# Altium schematic sheet WIFIModule.SchDoc
size A4; SheetNumber: 13; SheetTotal: 22
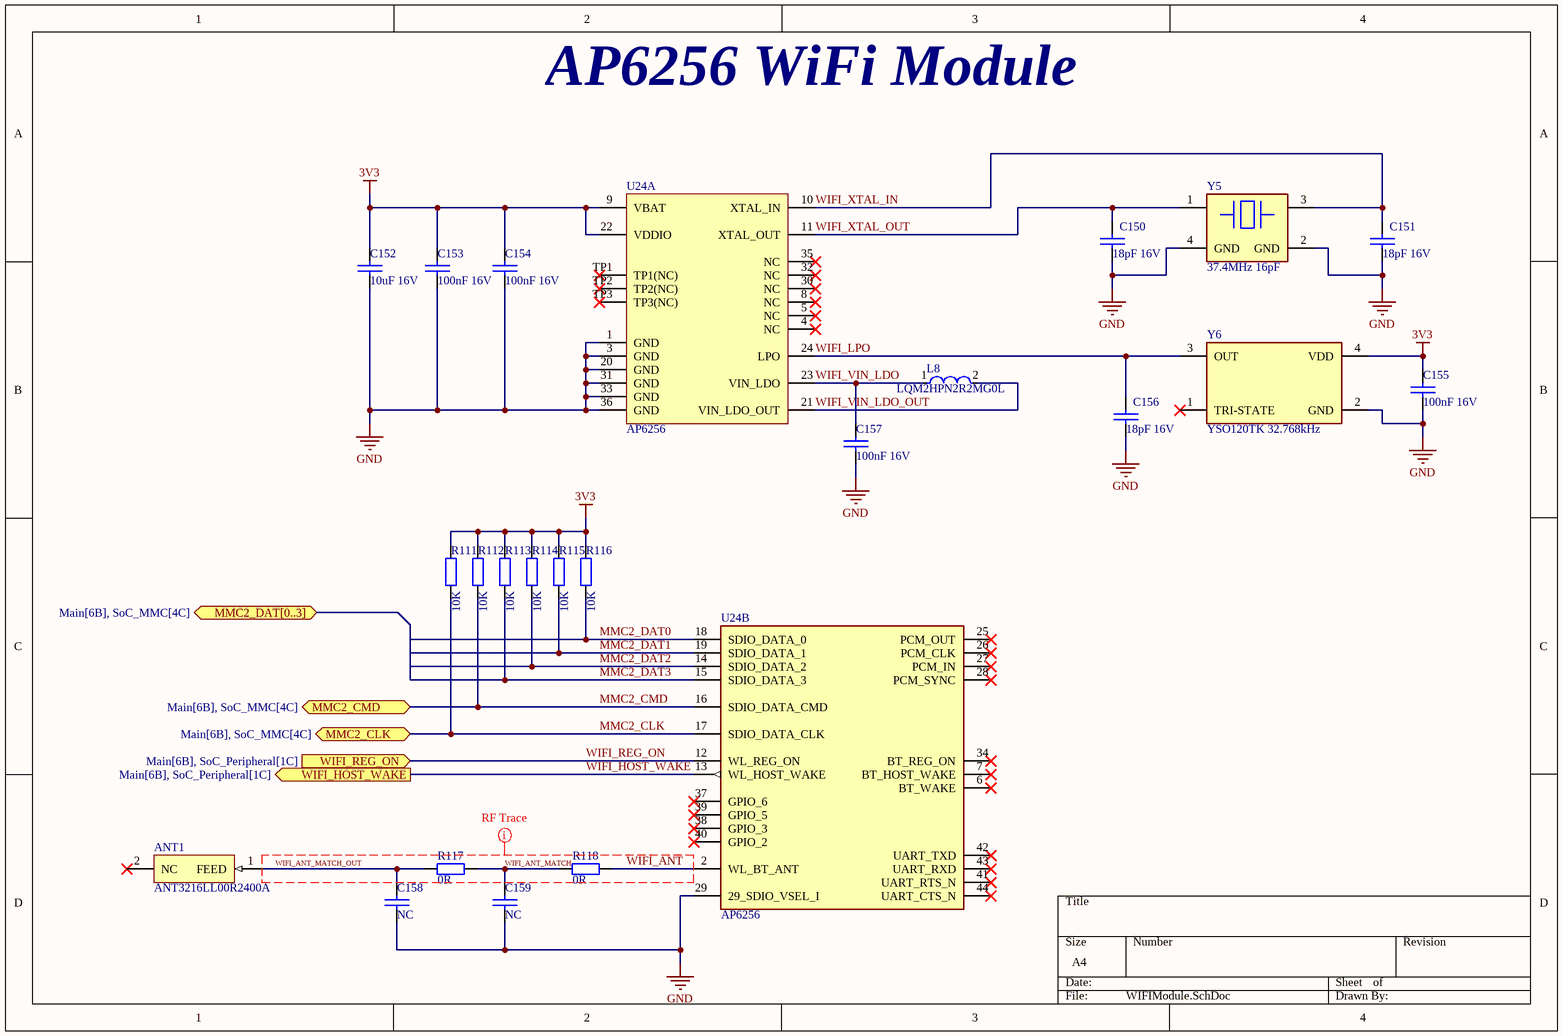
[diagram p0: WIFIModule.SchDoc]

## Parts
ANT1  ANT3216LL00R2400A  [ANT_1206]
C150  18pF 16V  [C_0402]
C151  18pF 16V  [C_0402]
C152  10uF 16V  [C_0603]
C153  100nF 16V  [C_0402]
C154  100nF 16V  [C_0402]
C155  100nF 16V  [C_0402]
C156  18pF 16V  [C_0402]
C157  100nF 16V  [C_0402]
C158  NC  [C_0402]
C159  NC  [C_0402]
L8  LQM2HPN2R2MG0L  [FP-LQM2HPN_G0-IPC_C]
R111  10K  [R_0402]
R112  10K  [R_0402]
R113  10K  [R_0402]
R114  10K  [R_0402]
R115  10K  [R_0402]
R116  10K  [R_0402]
R117  0R  [R_0402]
R118  0R  [R_0402]
U24  AP6256  [AP6256]  (parts A,B of 2)
Y5  37.4MHz 16pF  [CRYSTAL_SMD3225-4P]
Y6  YSO120TK 32.768kHz  [CRYSTAL_SMD3225-4P]

## Ports
MMC2_CLK (bidir, see Main[6B], SoC_MMC[4C]), MMC2_CMD (bidir, see Main[6B], SoC_MMC[4C]), MMC2_DAT[0..3] (bidir, see Main[6B], SoC_MMC[4C]), WIFI_HOST_WAKE (out, see Main[6B], SoC_Peripheral[1C]), WIFI_REG_ON (in, see Main[6B], SoC_Peripheral[1C])

## Nets
3V3: C152.1 C153.1 C154.1 C155.1 R111.2 R112.2 R113.2 R114.2 R115.2 R116.2 U24.9(VBAT) U24.22(VDDIO) Y6.4(VDD)
GND: C150.1 C151.1 C152.2 C153.2 C154.2 C155.2 C156.1 C157.2 C158.2 C159.2 U24.1(GND) U24.3(GND) U24.20(GND) U24.29(29_SDIO_VSEL_I) U24.31(GND) U24.33(GND) U24.36(GND) Y5.2(GND) Y5.4(GND) Y6.2(GND)
MMC2_CLK: R111.1 U24.17(SDIO_DATA_CLK) ; port MMC2_CLK
MMC2_CMD: R112.1 U24.16(SDIO_DATA_CMD) ; port MMC2_CMD
MMC2_DAT0: R116.1 U24.18(SDIO_DATA_0)
MMC2_DAT1: R115.1 U24.19(SDIO_DATA_1)
MMC2_DAT2: R114.1 U24.14(SDIO_DATA_2)
MMC2_DAT3: R113.1 U24.15(SDIO_DATA_3)
WIFI_ANT: R118.2 U24.2(WL_BT_ANT)
WIFI_ANT_MATCH: C159.1 R117.2 R118.1
WIFI_ANT_MATCH_OUT: ANT1.1(FEED) C158.1 R117.1
WIFI_HOST_WAKE: U24.13(WL_HOST_WAKE) ; port WIFI_HOST_WAKE
WIFI_LPO: C156.2 U24.24(LPO) Y6.3(OUT)
WIFI_REG_ON: U24.12(WL_REG_ON) ; port WIFI_REG_ON
WIFI_VIN_LDO: C157.1 L8.1 U24.23(VIN_LDO)
WIFI_VIN_LDO_OUT: L8.2 U24.21(VIN_LDO_OUT)
WIFI_XTAL_IN: C151.2 U24.10(XTAL_IN) Y5.3(CRYSTAL_2)
WIFI_XTAL_OUT: C150.2 U24.11(XTAL_OUT) Y5.1(CRYSTAL_1)

Not connected (* = marked no-connect by the designer): ANT1 2(NC)*; U24 4(NC)* 5(NC)* 6(BT_WAKE)* 7(BT_HOST_WAKE)* 8(NC)* 25(PCM_OUT)* 26(PCM_CLK)* 27(PCM_IN)* 28(PCM_SYNC)* 30(NC)* 32(NC)* 34(BT_REG_ON)* 35(NC)* 37(GPIO_6)* 38(GPIO_3)* 39(GPIO_5)* 40(GPIO_2)* 41(UART_RTS_N)* 42(UART_TXD)* 43(UART_RXD)* 44(UART_CTS_N)* TP1(TP1(NC))* TP2(TP2(NC))* TP3(TP3(NC))*; Y6 1(TRI-STATE)*

## Layout directives
net class RF_TRACE: WIFI_ANT, WIFI_ANT_MATCH, WIFI_ANT_MATCH_OUT

## Notes on the sheet
- AP6256 WiFi Module

## Library data of the parts
ANT1 = ANT3216LL00R2400A: 5.05dBi Chip Antenna Linear 160MHz 2450MHz 1W 1206 Antennas ROHS; Manufacturer: YAGEO; Manufacturer Part Number: ANT3216LL00R2400A; ComponentLink1Description: Datasheet Link; ComponentLink1URL: https://www.lcsc.com/datasheet/lcsc_datasheet_2410121536_YAGEO-ANT3216LL00R2400A_C293767.pdf
C150 C151 C153-C159 = C_0402: Capacitor 0402 SMD
C152 = C_0603: Capacitor 0603 SMD
L8 = CMP-1662-00028-2: Multilayer Type Inductor for Power Lines, 1008 (2520), 2.2μH, 20%, 0.1Ω, 1.3A; Core Material: Ferrite; DC Resistance (DCR): 100mR; Inductance: 2.2uH; Test Frequency: 1MHz; Self Resonant Frequency: 40MHz; Shielding: Shielded; Depth: 2.2mm; Length: 2.5mm; Max DC Current: 1.3A; Military Standard: Not; Current Rating: 1.3A; Termination: SMD/SMT; Radiation Hardening: No; Tolerance: 20%; Height: 1.2mm; Case Code (Metric): 2520; DC Current: 1.3A; Inductance Tolerance: 20%; Packaging: Tape and Reel; Width: 2mm; REACH SVHC: No SVHC; Mount: Surface Mount; Max Operating Temperature: 125°C; Lead Free: Lead Free; Case/Package: 1008; Case Code (Imperial): 1008; Series: LQM2HP_G0; Height - Seated (Max): 0.039inch; Package Quantity: 3000; Min Operating Temperature: -55°C
R111-R118 = R_0402: Resistor 0402 SMD
U24 = AP6256: Wi-Fi and Bluetooth 802.11a/b/g/n/ac; Manufacturer: AMPAK Tech; Manufacturer Part Number: AP6256; ComponentLink1Description: Datasheet Link; ComponentLink1URL: https://files.pine64.org/doc/datasheet/PinebookPro/AP6256%20datasheet_V1.7_12282018.pdf
Y5 = E3SB37E0X0004E: 37.4MHz 16pF ±10ppm ±10ppm SMD3225-4P Crystals ROHS; Manufacturer: Hosonic Elec; ComponentLink1Description: Datasheet Link; ComponentLink1URL: https://www.lcsc.com/datasheet/lcsc_datasheet_2410121523_Hosonic-Elec-E3SB37E0X0004E_C2687892.pdf; Manufacturer Part Number: E3SB37E0X0004E
Y6 = YSO120TK: 1.8V~3.3V ±10ppm ±20ppm CMOS 32.768kHz SMD3225-4P Crystal Oscillators ROHS; Manufacturer: YXC Crystal Oscillators; Manufacturer Part Number: OK2EL89CJI-111YLC-32.768K; ComponentLink1Description: Datasheet Link; ComponentLink1URL: https://www.lcsc.com/datasheet/lcsc_datasheet_2407310922_YXC-Crystal-Oscillators-OK2EL89CJI-111YLC-32-768K_C5280579.pdf